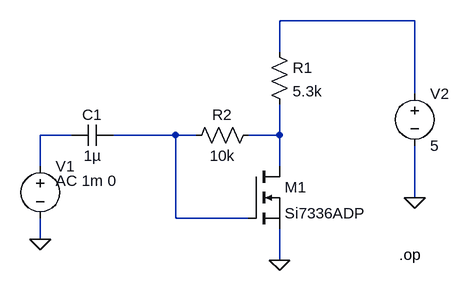
[diagram p0: schematic mosfet.asc]
mosfet.asc, the LTspice schematic file:
Version 4
SHEET 1 880 680
WIRE 656 64 448 64
WIRE 448 112 448 64
WIRE 656 176 656 64
WIRE 128 240 80 240
WIRE 288 240 192 240
WIRE 320 240 288 240
WIRE 448 240 448 192
WIRE 448 240 400 240
WIRE 80 288 80 240
WIRE 448 288 448 240
WIRE 656 336 656 256
WIRE 288 368 288 240
WIRE 400 368 288 368
WIRE 80 400 80 368
WIRE 448 432 448 384
FLAG 448 432 0
FLAG 80 400 0
FLAG 656 336 0
DATAFLAG 448 240 "$"
SYMBOL res 432 96 R0
SYMATTR InstName R1
SYMATTR Value 5.3k
SYMBOL res 416 224 R90
WINDOW 0 0 56 VBottom 2
WINDOW 3 32 56 VTop 2
SYMATTR InstName R2
SYMATTR Value 10k
SYMBOL cap 192 224 R90
WINDOW 0 0 32 VBottom 2
WINDOW 3 32 32 VTop 2
SYMATTR InstName C1
SYMATTR Value 1µ
SYMBOL voltage 80 272 R0
WINDOW 123 24 38 Left 2
SYMATTR InstName V1
SYMATTR Value ""
SYMATTR Value2 AC 1m 0
SYMBOL voltage 656 160 R0
SYMATTR InstName V2
SYMATTR Value 5
SYMBOL nmos 400 288 R0
SYMATTR InstName M1
SYMATTR Value Si7336ADP
TEXT 632 424 Left 2 !.op

The netlist it stands for:
* mosfet.asc
R1 N001 N004 5.3k
R2 N004 N003 10k
C1 N003 N002 1µ
V1 N002 0 AC 1m 0
V2 N001 0 5
M1 N004 N003 0 0 Si7336ADP
.model NMOS NMOS
.model PMOS PMOS
.lib standard.mos
.op
.backanno
.end